# EAGLE schematic PowerButton (EAGLE 9.6.2)
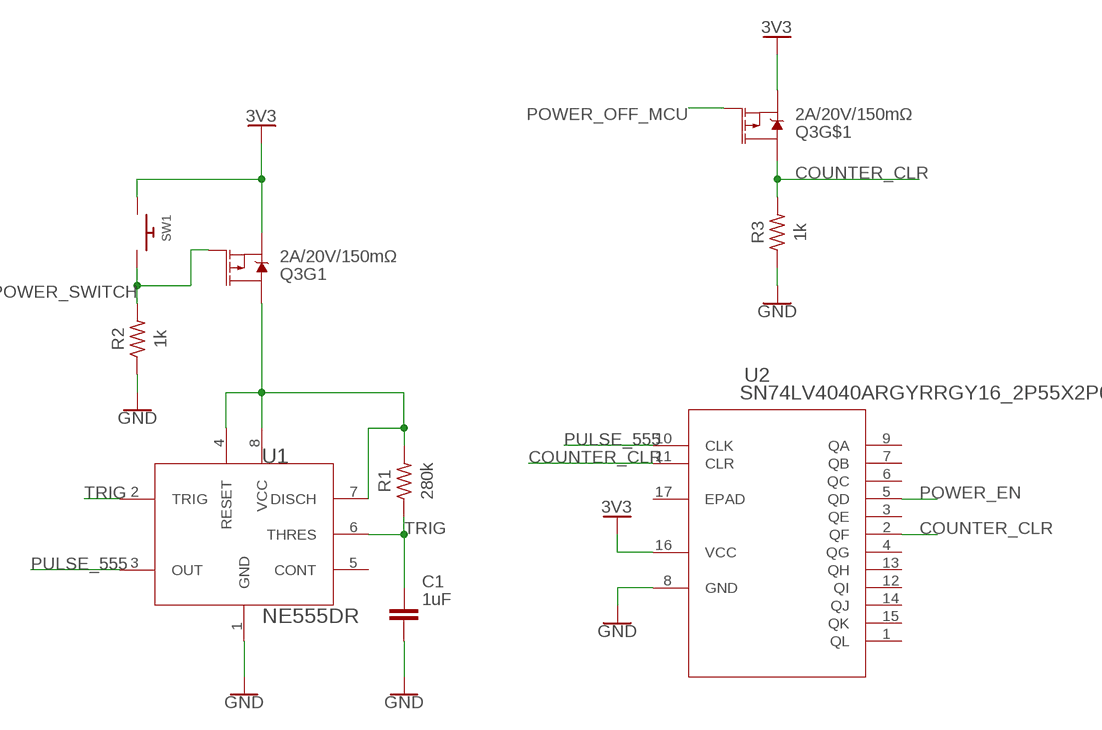
[diagram p0: schematic, sheet 1]

## Parts
C1  1uF  C_CHIP-0603(1608-METRIC)  [CAPC1608X85]
Q3  2A/20V/150mΩ  MOSFET_PCH_DUAL-DMP2240UDM  [SOT26]
R1  280k  R-US_CHIP-0603(1608-METRIC)  [RESC1608X60]
R2  1k  R-US_CHIP-0603(1608-METRIC)  [RESC1608X60]
R3  1k  R-US_CHIP-0603(1608-METRIC)  [RESC1608X60]
SW1  SWITCH_PUSHBUTTONSOFTTOUCHSMD_SJ  [PUSHBUTTON_SMD_SJ]
U1  NE555DR  [SOIC-8N]
U2  SN74LV4040ARGYRRGY16_2P55X2P05  [RGY16_2P55X2P05]

## Nets
3V3: Q3.S1(S) Q3.S2(S) SW1.P$1 U2.16(VCC)
COUNTER_CLR: Q3.D2(D) R3.2 U2.2(QF) U2.11(CLR)
GND: C1.2 R2.1 R3.1 U1.1(GND) U2.8(GND)
N$3: Q3.D1(D) R1.2 U1.4(RESET) U1.7(DISCH) U1.8(VCC)
POWER_EN: U2.5(QD)
POWER_OFF_MCU: Q3.G2(G)
POWER_SWITCH: Q3.G1(G) R2.2 SW1.P$2
PULSE_555: U1.3(OUT) U2.10(CLK)
TRIG: C1.1 R1.1 U1.2(TRIG) U1.6(THRES)
Unconnected: U1.5(CONT) U2.1(QL) U2.3(QE) U2.4(QG) U2.6(QC) U2.7(QB) U2.9(QA) U2.12(QI) U2.13(QH) U2.14(QJ) U2.15(QK) U2.17(EPAD)

## Library data of the parts
C1 = Capacitor:C: Capacitor - Generic; CATEGORY: Capacitor
Q3 = SparkFun-DiscreteSemi:MOSFET_PCH_DUAL: Dual P-Channel -20VDS MOSFET Link to datasheet <http://www.diodes.com/_files/datasheets/ds31197.pdf> SparkFun Products: SparkFun FreeSoC2 Development Board <https://www.sparkfun.com/products/13229>; PROD_ID: TRANS-12444
R1-R3 = Resistor:R-US: Resistor Fixed - ANSI; CATEGORY: Resistor; SUB-CATEGORY: Fixed
SW1 = adafruit:SWITCH_PUSHBUTTON: Buttons SOFTTOUCHSMD_SJ - Soft touch temporary push button (Super Junk Akihabara) Compatible with SKPMANE010 [Mouser: 688-SKPMAN] C&K_KSS = Digikey: KSS221GLFS
U1 = IC:NE555DR: IC OSC SGL TIMER 100KHZ 8-SOIC Manufacturer's datasheet <http://www.ti.com/general/docs/suppproductinfo.tsp?distId=10&gotoUrl=http%3A%2F%2Fwww.ti.com%2Flit%2Fgpn%2Fne555>; CREATED_BY: PCBLayout.com; DIGI-KEY_PART: 296-6501-1-ND; MANUFACTURER: Texas Instruments; MPN: NE555DR; PACKAGE: SOIC-8
U2 = 2024-03-07_02-24-03_Library:SN74LV4040ARGYR; COPYRIGHT: Copyright (C) 2024 Ultra Librarian. All rights reserved.; MANUFACTURER_PART_NUMBER: SN74LV4040ARGYR; MFR_NAME: Texas Instruments